# EAGLE schematic music_box (EAGLE 6.3)
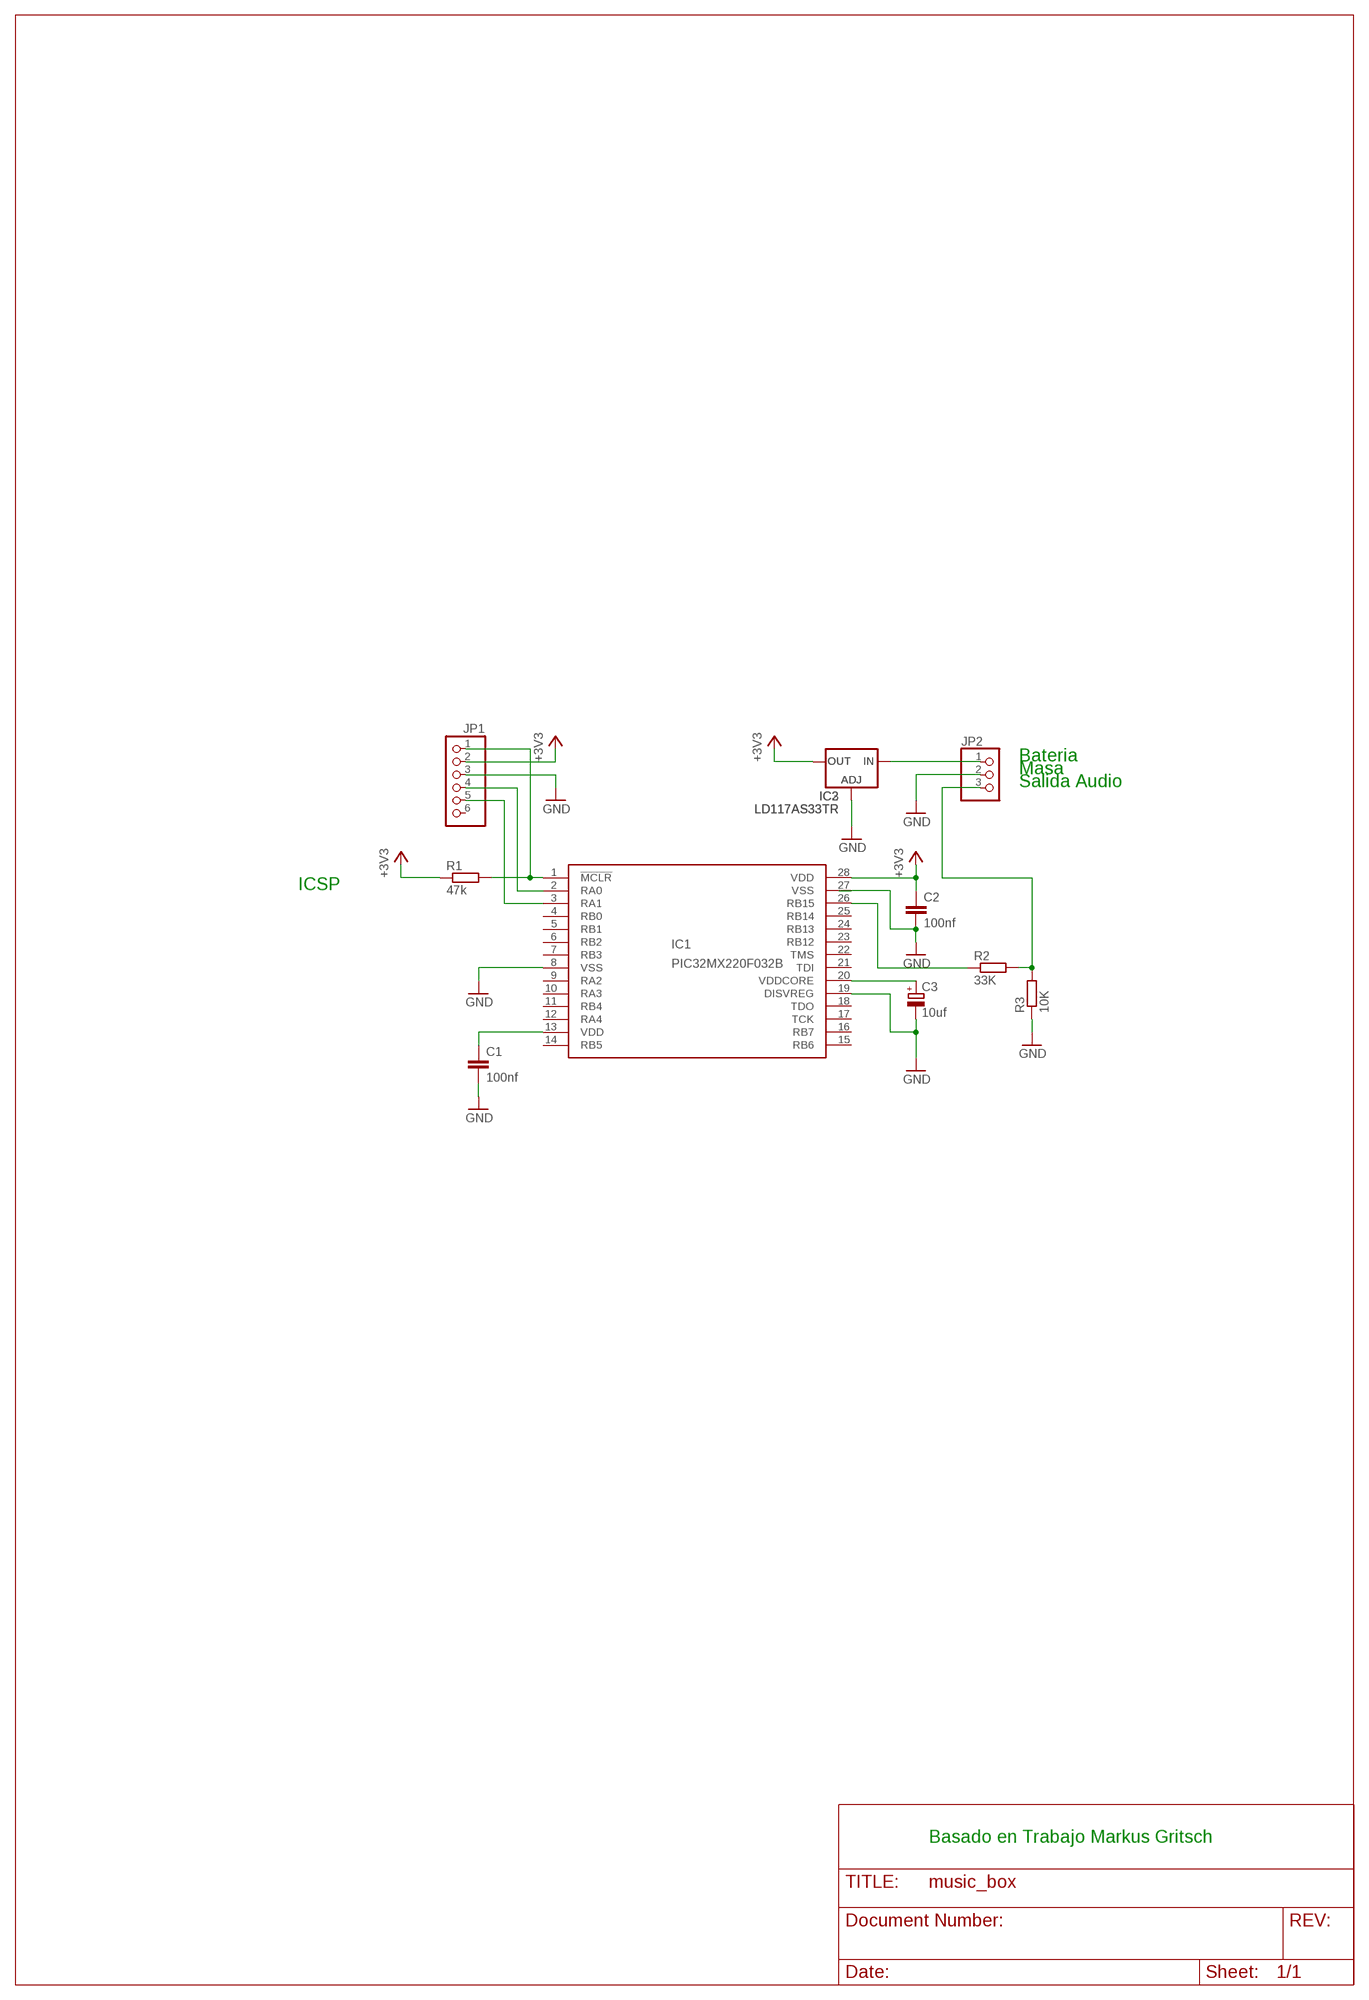
[diagram p0: schematic, sheet 1]

## Parts
C1  100nf  C-EU025-024X044  [C025-024X044]
C2  100nf  C-EU025-024X044  [C025-024X044]
C3  10uf  CPOL-EUC/6032-28W  [C/6032-28W]
IC1  PIC32MX220F032B  PIC24FJ32GA002  [DIL28-3]
IC2  LD117AS33TR  [SOT223]
IC3  LD117AS33TR  [SOT223]
JP1  PINHD-1X6  [1X06]
JP2  PINHD-1X3  [1X03]
R1  47k  R-EU_0204/5  [0204/5]
R2  33K  R-EU_0204/5  [0204/5]
R3  10K  R-EU_0204/5  [0204/5]

## Nets
+3V3: C2.1 IC1.28(VDD) IC2.4(OUT) IC3.4(OUT) JP1.2 R1.1
GND: C1.2 C2.2 C3.- IC1.8(VSS) IC1.19(DISVREG) IC1.27(VSS) IC2.1(ADJ) IC3.1(ADJ) JP1.3 JP2.2 R3.1
N$1: IC2.3(IN) IC3.3(IN) JP2.1
N$2: C1.1 IC1.13(VDD)
N$3: C3.+ IC1.20(VDDCORE)
N$4: IC1.1(!MCLR) JP1.1 R1.2
N$8: IC1.2(RA0) JP1.4
N$9: IC1.3(RA1) JP1.5
N$10: IC1.26(RB15) R2.1
N$11: JP2.3 R2.2 R3.2
Unconnected: IC1.4(RB0) IC1.5(RB1) IC1.6(RB2) IC1.7(RB3) IC1.9(RA2) IC1.10(RA3) IC1.11(RB4) IC1.12(RA4) IC1.14(RB5) IC1.15(RB6) IC1.16(RB7) IC1.17(TCK) IC1.18(TDO) IC1.21(TDI) IC1.22(TMS) IC1.23(RB12) IC1.24(RB13) IC1.25(RB14) JP1.6

## Notes on the sheet
- Bateria
- Masa
- Salida Audio
- ICSP
- Basado en Trabajo Markus Gritsch

## Library data of the parts
C1 C2 = resistor:C-EU: CAPACITOR, European symbol
C3 = resistor:CPOL-EU: POLARIZED CAPACITOR, European symbol
IC1 = microchip:PIC24FJ32GA002: PIC24FJ32GA002 edit this description Auto generated by make-symbol-device-package-bsdl.ulp Rev. 25 Source: PIC24FJ32GA002.bsd; MPN: PIC32MX220F032B-I/SP; OC_FARNELL: 1332294; OC_NEWARK: 88K6123
IC2 IC3 = v-reg:LD117A?*: Low drop fixed and adjustable positive voltage regulators 1 A Source: http://www.st.com/stonline/products/literature/ds/7194/ld1117axx.pdf
JP1 = pinhead:PINHD-1X6: PIN HEADER
JP2 = pinhead:PINHD-1X3: PIN HEADER
R1-R3 = rcl:R-EU_: RESISTOR, European symbol